# EasyEDA schematic SCH_NewRainSensor_2024-05-19.json
TITLE: Rain Sensor; REV: 1.0; Date: 2024-05-09; Sheet: 1/1; Drawn By: IS; Company: N/A
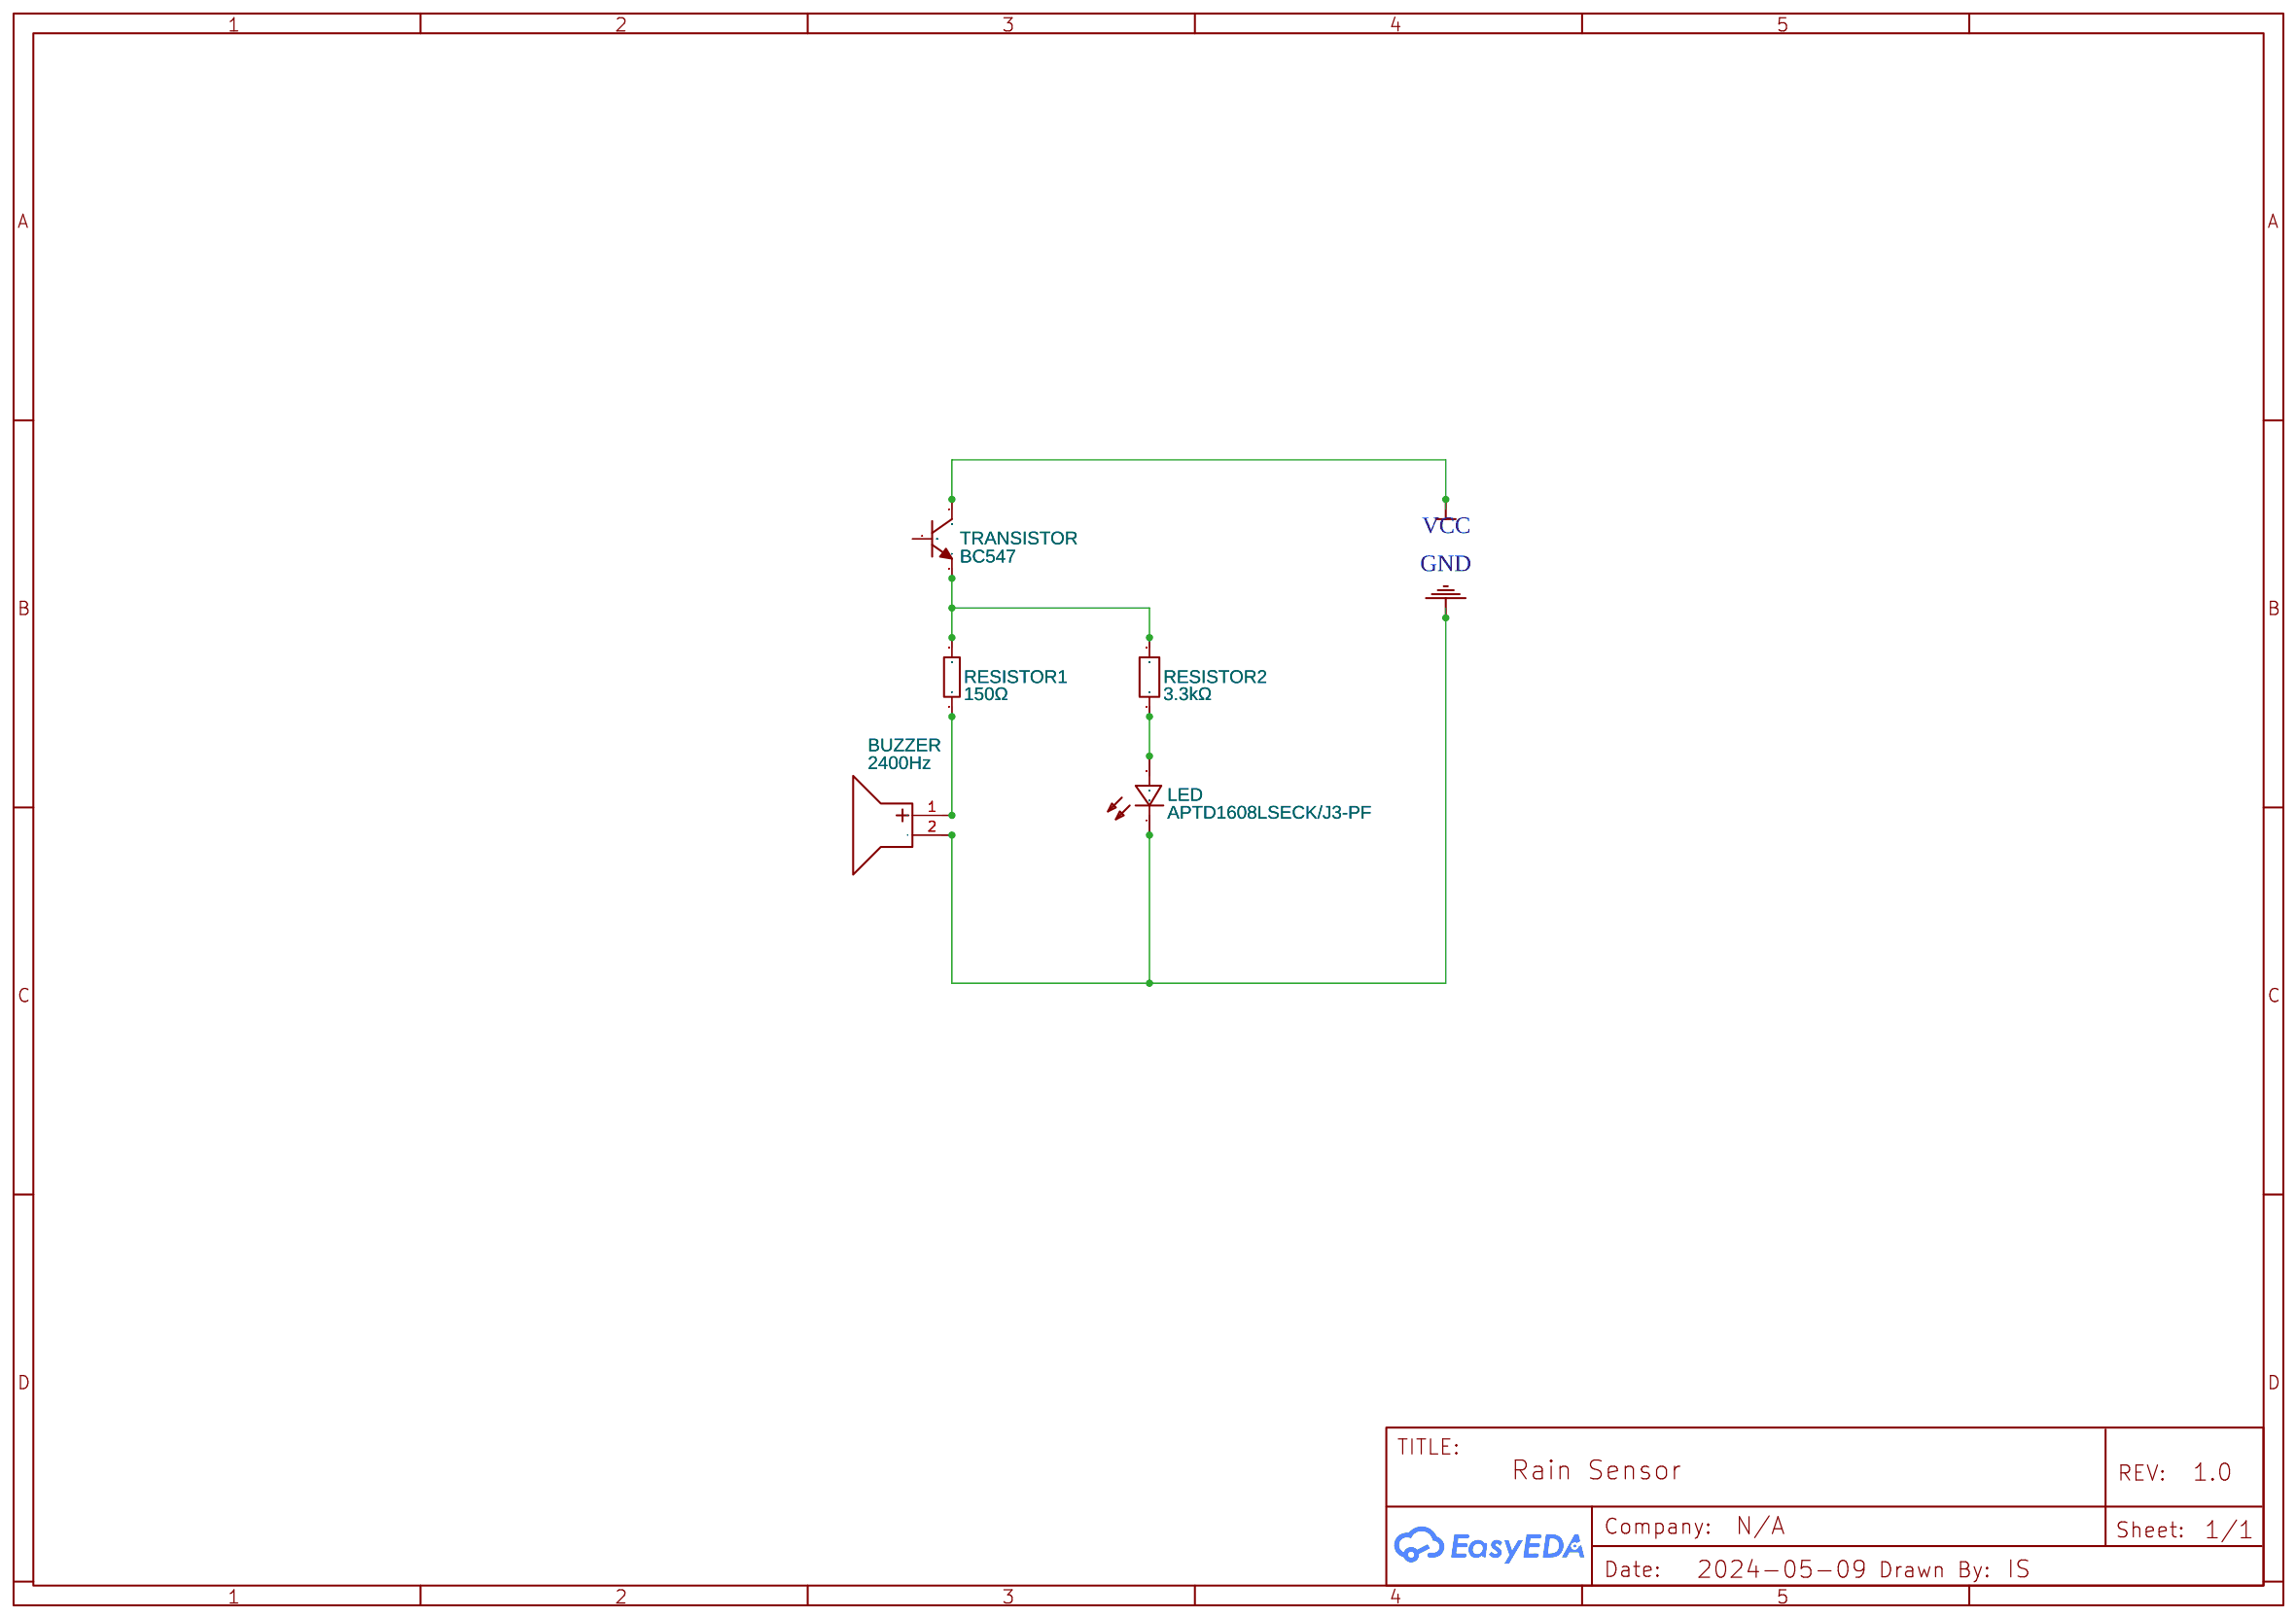
[diagram p0: schematic sheet]

## Parts
BUZZER  2400Hz  [BUZ-SMD_FUET-1365-XXV]
LED  APTD1608LSECK/J3-PF  [LED-SMD_L1.6-W0.8-RD]
RESISTOR1  150Ω  [R1206]
RESISTOR2  3.3kΩ  [R0603]
TRANSISTOR  BC547  [TO-92-3_L4.5-W3.5-P1.27-L]

## Library data of the parts
BUZZER = FUET-1365-5V: Contributor: LCSC; Supplier: LCSC; Supplier Part: C417423; Manufacturer: FUET(福声科技); JLCPCB Part Class: Extended Part
LED = APTD1608LSECK/J3-PF: Contributor: lcsc; Supplier: LCSC; Supplier Part: C5879214; Manufacturer: Kingbright; JLCPCB Part Class: Extended Part
RESISTOR1 = AECR1206F150RK9: Contributor: LCSC; Supplier: LCSC; Supplier Part: C352147; Manufacturer: RESI(开步睿思）; JLCPCB Part Class: Extended Part
RESISTOR2 = ERJ3GEYJ332V: Contributor: LCSC; Supplier: LCSC; Supplier Part: C403480; Manufacturer: PANASONIC(松下); JLCPCB Part Class: Extended Part
TRANSISTOR = BC547: Contributor: LCSC; Supplier: LCSC; Supplier Part: C2910381; Manufacturer: CJ(江苏长电/长晶); Manufacturer Part: BC547(RANGE:420-800); JLCPCB Part Class: Extended Part

## Nets
GND: BUZZER.2(-) LED.1(C)
VCC: TRANSISTOR.1(C)
Net-(BUZZER-1): BUZZER.1(+) RESISTOR1.1
Net-(LED-2): LED.2(A) RESISTOR2.1
Net-(RESISTOR1-2): RESISTOR1.2 RESISTOR2.2 TRANSISTOR.3(E)

Not connected (* = marked no-connect by the designer): TRANSISTOR 2(B)
